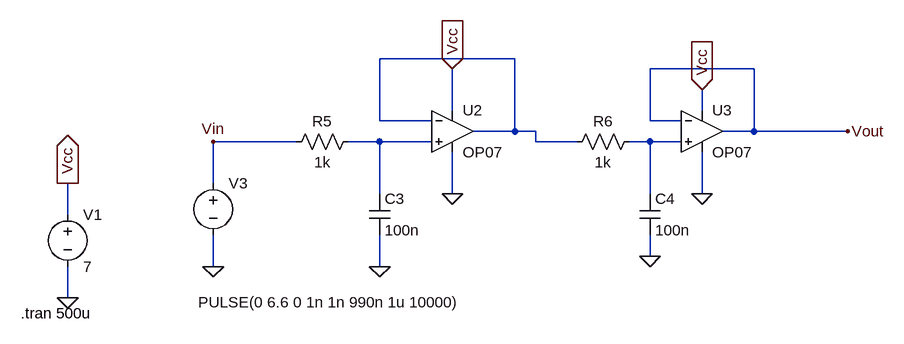
[diagram p0: schematic Filter.asc]
Filter.asc, the LTspice schematic file:
Version 4
SHEET 1 1128 680
WIRE 400 -448 192 -448
WIRE 768 -432 608 -432
WIRE 304 -368 304 -432
WIRE 688 -368 688 -400
WIRE 192 -352 192 -448
WIRE 272 -352 192 -352
WIRE 608 -352 608 -432
WIRE 656 -352 608 -352
WIRE 400 -336 400 -448
WIRE 400 -336 336 -336
WIRE 432 -336 400 -336
WIRE 768 -336 768 -432
WIRE 768 -336 720 -336
WIRE 912 -336 768 -336
WIRE 64 -320 -64 -320
WIRE 192 -320 144 -320
WIRE 272 -320 192 -320
WIRE 432 -320 432 -336
WIRE 496 -320 432 -320
WIRE 608 -320 576 -320
WIRE 656 -320 608 -320
WIRE -64 -256 -64 -320
WIRE 192 -240 192 -320
WIRE 304 -240 304 -304
WIRE 608 -240 608 -320
WIRE 688 -240 688 -304
WIRE -288 -208 -288 -256
WIRE 608 -144 608 -176
WIRE -64 -128 -64 -176
WIRE 192 -128 192 -176
WIRE -288 -80 -288 -128
FLAG -288 -80 0
FLAG -288 -256 Vcc
IOPIN -288 -256 Out
FLAG 304 -432 Vcc
IOPIN 304 -432 In
FLAG -64 -320 Vin
FLAG 912 -336 Vout
FLAG -64 -128 0
FLAG 192 -128 0
FLAG 608 -144 0
FLAG 688 -400 Vcc
IOPIN 688 -400 In
FLAG 304 -240 0
FLAG 688 -240 0
SYMBOL voltage -288 -224 R0
WINDOW 123 0 0 Left 0
WINDOW 39 0 0 Left 0
SYMATTR InstName V1
SYMATTR Value 7
SYMBOL OpAmps\\OP07 304 -400 R0
SYMATTR InstName U2
SYMBOL OpAmps\\OP07 688 -400 R0
SYMATTR InstName U3
SYMBOL voltage -64 -272 R0
WINDOW 3 -23 199 Left 2
WINDOW 123 0 0 Left 0
WINDOW 39 0 0 Left 0
SYMATTR InstName V3
SYMATTR Value PULSE(0 6.6 0 1n 1n 990n 1u 10000)
SYMBOL res 160 -336 R90
WINDOW 0 0 56 VBottom 2
WINDOW 3 32 56 VTop 2
SYMATTR InstName R5
SYMATTR Value 1k
SYMBOL cap 176 -240 R0
SYMATTR InstName C3
SYMATTR Value 100n
SYMBOL cap 592 -240 R0
SYMATTR InstName C4
SYMATTR Value 100n
SYMBOL res 592 -336 R90
WINDOW 0 0 56 VBottom 2
WINDOW 3 32 56 VTop 2
SYMATTR InstName R6
SYMATTR Value 1k
TEXT -360 -56 Left 2 !.tran 500u

The netlist it stands for:
* Filter.asc
V1 Vcc 0 7
XU2 N002 N001 Vcc 0 N001 LT1001  ; OP07, pins In+ In- V+ V- OUT
XU3 N003 Vout Vcc 0 Vout LT1001  ; OP07, pins In+ In- V+ V- OUT
V3 Vin 0 PULSE(0 6.6 0 1n 1n 990n 1u 10000)
R5 N002 Vin 1k
C3 N002 0 100n
C4 N003 0 100n
R6 N003 N001 1k
.tran 500u
.lib LTC.lib
.backanno
.end